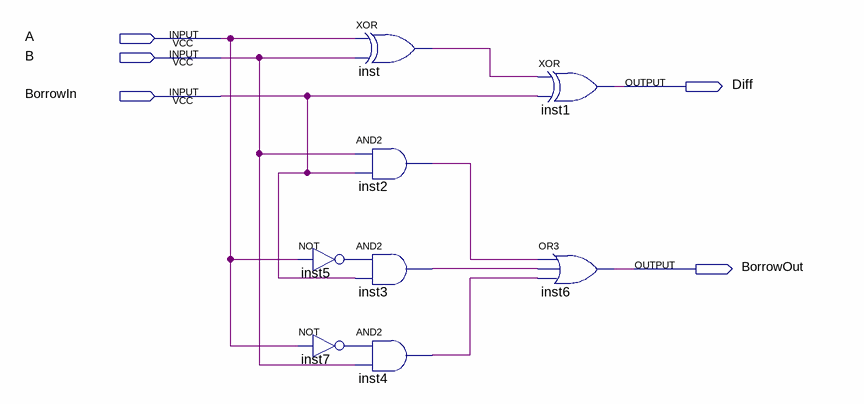
[diagram p0: schematic sheet]
// Quartus schematic Full-Sub.bdf as structural Verilog: 8 symbols, 5 pins
module \Full-Sub  (
  input  A,
  input  B,
  input  BorrowIn,
  output Diff,
  output BorrowOut
);

  wire inst2_out, inst3_out, inst4_out, inst5_out, inst7_out, inst_out;

  not inst5 (inst5_out, A);
  not inst7 (inst7_out, A);
  xor inst (inst_out, A, B);
  and inst2 (inst2_out, B, BorrowIn);
  and inst3 (inst3_out, inst5_out, BorrowIn);
  and inst4 (inst4_out, inst7_out, B);
  xor inst1 (Diff, inst_out, BorrowIn);
  or inst6 (BorrowOut, inst2_out, inst3_out, inst4_out);
endmodule
